# EAGLE schematic SETBOARD (EAGLE 7.4.0)
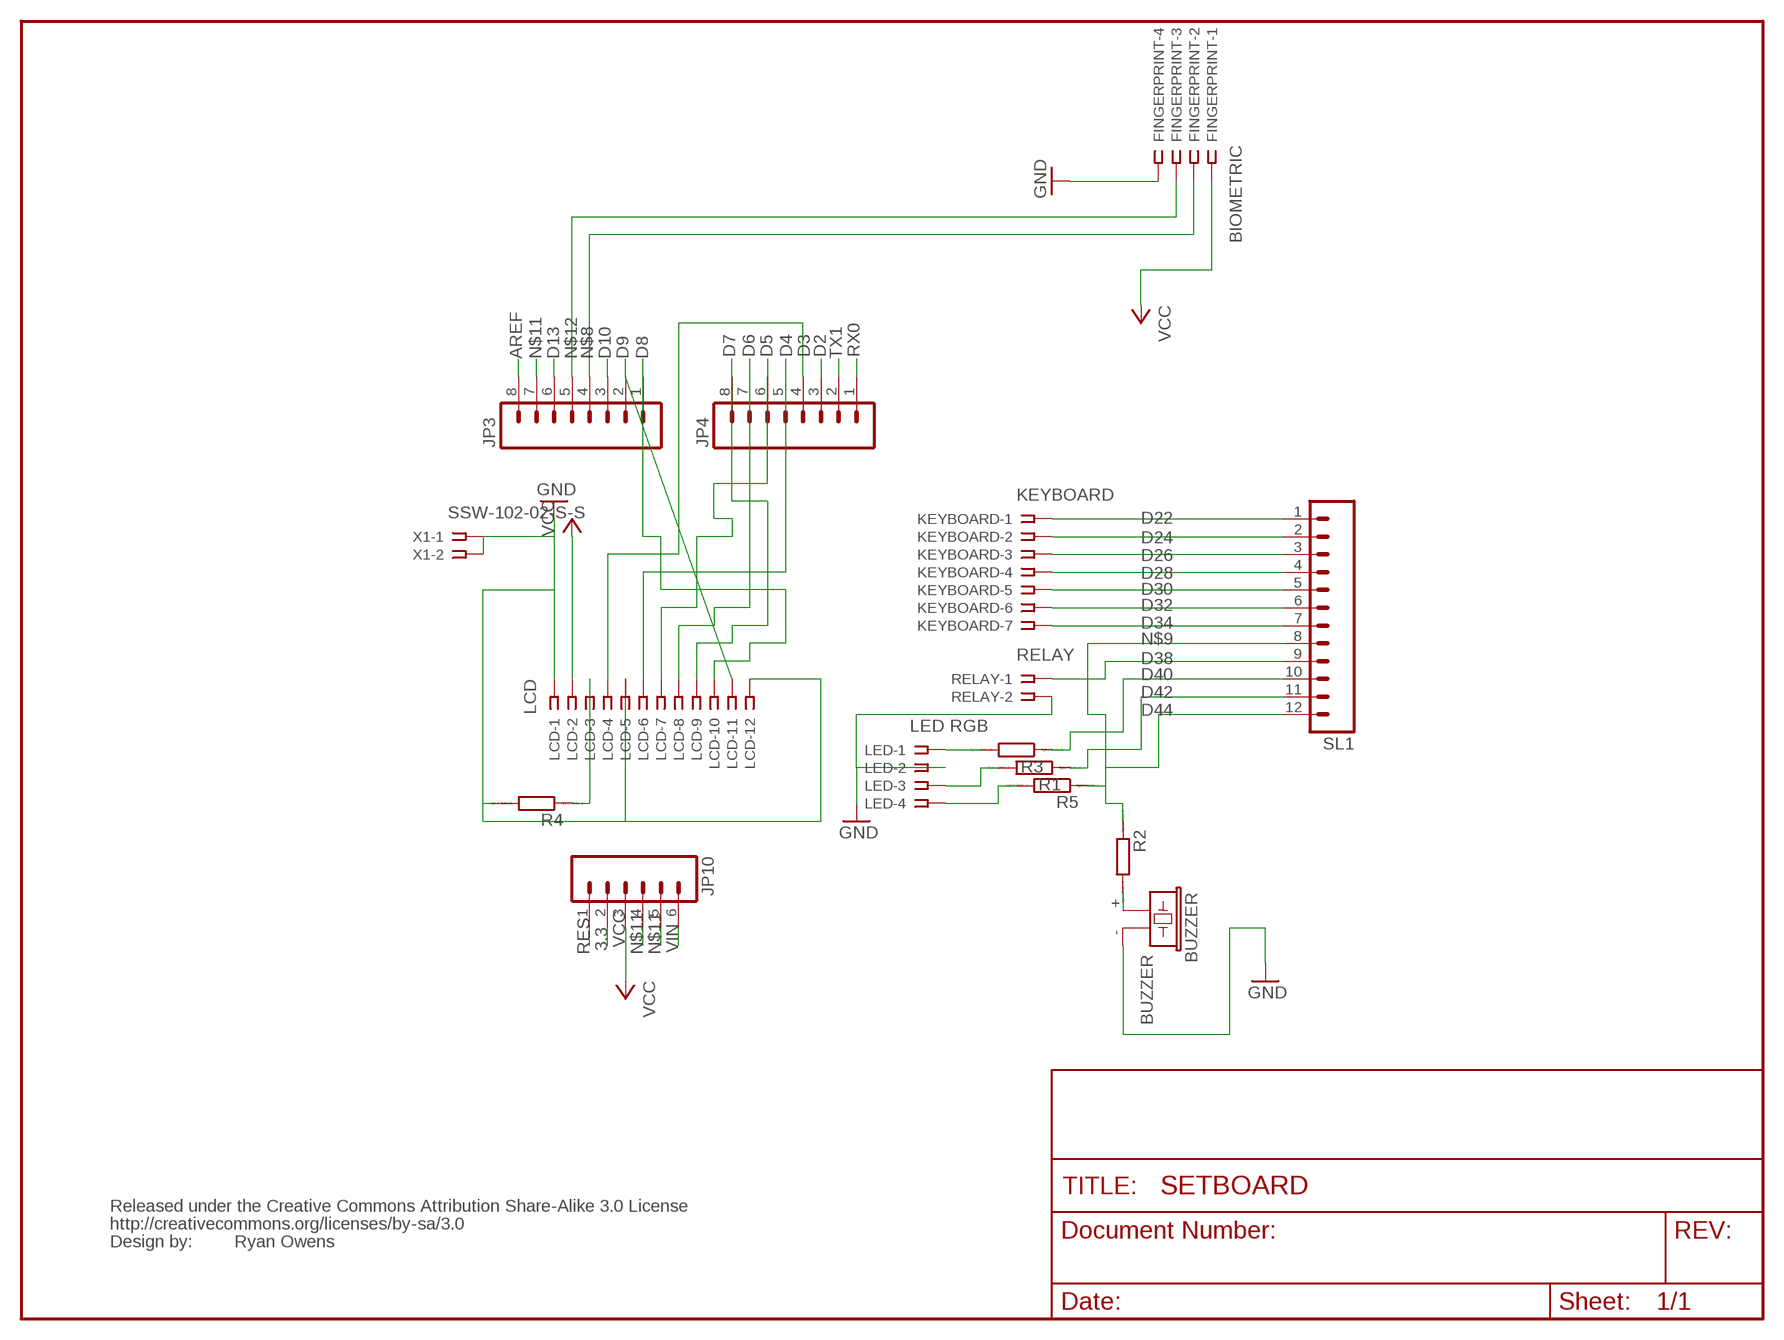
[diagram p0: schematic, sheet 1]

## Parts
BUZZER  BUZZER  F/CM12P  [F/CM12P]
FINGERPRINT  BIOMETRIC  SSW-104-02-S-S  [SSW-104-02-S-S]
JP3  M08LOCK  [1X08_LOCK]
JP4  M08LOCK  [1X08_LOCK]
JP10  M06LOCK  [1X06_LOCK]
KEYBOARD  KEYBOARD  SSW-107-02-S-S  [SSW-107-02-S-S]
LCD  LCD  SSW-112-02-S-S  [SSW-112-02-S-S]
LED  LED RGB  SSW-104-02-S-S  [SSW-104-02-S-S]
R1  R0207/10  [0207/10]
R2  R0207/10  [0207/10]
R3  R0207/10  [0207/10]
R4  R0207/10  [0207/10]
R5  R0207/10  [0207/10]
RELAY  RELAY  SSW-102-02-S-S  [SSW-102-02-S-S]
SL1  M12  [12P]
U$2  CREATIVE_COMMONS  [CREATIVE_COMMONS]
X1  SSW-102-02-S-S  [SSW-102-02-S-S]

## Nets
3.3: JP10.2
AREF: JP3.8
D2: JP4.3
D3: JP4.4 LCD.4
D4: JP4.5 LCD.6
D5: JP4.6 LCD.7
D6: JP4.7 LCD.8
D7: JP4.8 LCD.9
D8: JP3.1 LCD.10
D9: JP3.2 LCD.11
D10: JP3.3
D13: JP3.6
D22: KEYBOARD.1 SL1.1
D24: KEYBOARD.2 SL1.2
D26: KEYBOARD.3 SL1.3
D28: KEYBOARD.4 SL1.4
D30: KEYBOARD.5 SL1.5
D32: KEYBOARD.6 SL1.6
D34: KEYBOARD.7 SL1.7
D38: RELAY.1 SL1.9
D40: R3.1 SL1.10
D42: R1.1 SL1.11
D44: R5.1 SL1.12
N$1: LCD.3 R4.1
N$2: LED.1 R3.2
N$3: LED.3 R1.2
N$4: LED.4 R5.2
N$5: BUZZER.+ R2.2
N$8: FINGERPRINT.2 JP3.4
N$9: R2.1 SL1.8
N$11: BUZZER.- FINGERPRINT.4 JP3.7 JP10.4 JP10.5 LCD.1 LCD.5 LCD.12 LED.2 R4.2 RELAY.2 X1.1 X1.2 ; supply symbol labelled GND
N$12: FINGERPRINT.3 JP3.5
RES: JP10.1
RX0: JP4.1
TX1: JP4.2
VCC: FINGERPRINT.1 JP10.3 LCD.2
VIN: JP10.6

## Notes on the sheet
- Ryan Owens

## Library data of the parts
BUZZER = buzzer:F/CM12P: BUZZER Source: Buerklin; OC_FARNELL: unknown; OC_NEWARK: unknown
FINGERPRINT LED = con-samtec:SSW-104-02-S-S: THROUGH-HOLE .025" SQ POST SOCKET Source: Samtec SSW.pdf; MPN: SSW-104-02-S-S; OC_FARNELL: unknown; OC_NEWARK: 11P9384
JP3 JP4 = SparkFun:M08: Header 8 Standard 8-pin 0.1" header. Use with straight break away headers (SKU : PRT-00116), right angle break away headers (PRT-00553), swiss pins (PRT-00743), machine pins (PRT-00117), and female headers (PRT-00115).
JP10 = SparkFun:M06: Header 6 Standard 6-pin 0.1" header. Use with straight break away headers (SKU : PRT-00116), right angle break away headers (PRT-00553), swiss pins (PRT-00743), machine pins (PRT-00117), and female headers (PRT-00115). Molex polarized connector foot print use with SKU : PRT-08094 with associated crimp pins and housings. NOTES ON THE VARIANTS LOCK and LOCK_LONGPADS... This footprint was designed to help hold the alignment of a through-hole component (i.e. 6-pin header) while soldering it into place. You may notice that each hole has been shifted either up or down by 0.005 of an inch from it's more standard position (which is a perfectly straight line). This slight alteration caused the pins (the squares in the middle) to touch the edges of the holes. Because they are alternating, it causes a "brace" to hold the component in place. 0.005 has proven to be the perfect amount of "off-center" position when using our standard breakaway headers. Although looks a little odd when you look at the bare footprint, once you have a header in there, the alteration is very hard to notice. Also, if you push a header all the way into place, it is covered up entirely on the bottom side. This idea of altering the position of holes to aid alignment will be further integrated into the Sparkfun Library for other footprints. It can help hold any component with 3 or more connection pins.
KEYBOARD = con-samtec:SSW-107-02-S-S: THROUGH-HOLE .025" SQ POST SOCKET Source: Samtec SSW.pdf; MPN: SSW-107-02-S-S; OC_FARNELL: unknown; OC_NEWARK: 11P9433
LCD = con-samtec:SSW-112-02-S-S: THROUGH-HOLE .025" SQ POST SOCKET Source: Samtec SSW.pdf; MPN: SSW-112-02-S-S; OC_FARNELL: unknown; OC_NEWARK: 11P9515
R1-R5 = eagle-ltspice:R: RESISTOR, European symbol; SPICEMODEL: NONE; SPICEPREFIX: R
RELAY X1 = con-samtec:SSW-102-02-S-S: THROUGH-HOLE .025" SQ POST SOCKET Source: Samtec SSW.pdf; MPN: SSW-102-02-S-S; OC_FARNELL: unknown; OC_NEWARK: 11P9351
SL1 = con-amp-quick:M12: AMP QUICK CONNECTOR; OC_FARNELL: unknown; OC_NEWARK: unknown
U$2 = SparkFun:CREATIVE_COMMONS